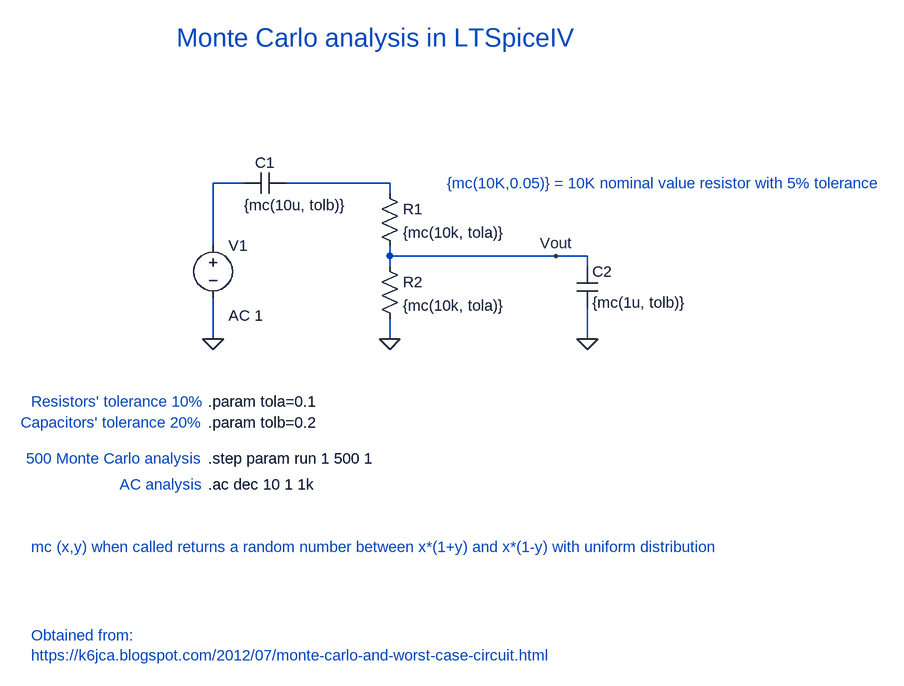
[diagram p0: schematic Monte-Carlo-Simulation-LTSpice.asc]
Monte-Carlo-Simulation-LTSpice.asc, the LTspice schematic file:
Version 4.1
SHEET 1 1064 788
WIRE 48 48 0 48
WIRE 272 48 112 48
WIRE 272 64 272 48
WIRE 0 144 0 48
WIRE 272 160 272 144
WIRE 528 160 272 160
WIRE 576 160 528 160
WIRE 272 176 272 160
WIRE 576 176 576 160
WIRE 0 288 0 224
WIRE 272 288 272 256
WIRE 576 288 576 240
FLAG 0 288 0
FLAG 272 288 0
FLAG 576 288 0
FLAG 528 160 Vout
SYMBOL voltage 0 128 R0
WINDOW 123 24 124 Left 2
WINDOW 39 0 0 Left 0
SYMATTR InstName V1
SYMATTR Value ""
SYMATTR Value2 AC 1
SYMBOL cap 112 32 R90
WINDOW 0 0 32 VBottom 2
WINDOW 3 34 -15 VTop 2
SYMATTR InstName C1
SYMATTR Value {mc(10u, tolb)}
SYMBOL res 256 48 R0
SYMATTR InstName R1
SYMATTR Value {mc(10k, tola)}
SYMBOL res 256 160 R0
SYMATTR InstName R2
SYMATTR Value {mc(10k, tola)}
SYMBOL cap 560 176 R0
SYMATTR InstName C2
SYMATTR Value {mc(1u, tolb)}
TEXT -8 384 Left 2 !.param tola=0.1
TEXT -8 416 Left 2 !.param tolb=0.2
TEXT -8 472 Left 2 !.step param run 1 500 1
TEXT -8 512 Left 2 !.ac dec 10 1 1k
TEXT -280 608 Left 2 ;mc (x,y) when called returns a random number between x*(1+y) and x*(1-y) with uniform distribution
TEXT 360 48 Left 2 ;{mc(10K,0.05)} = 10K nominal value resistor with 5% tolerance
TEXT -280 384 Left 2 ;Resistors' tolerance 10%
TEXT -296 416 Left 2 ;Capacitors' tolerance 20%
TEXT -288 472 Left 2 ;500 Monte Carlo analysis
TEXT -144 512 Left 2 ;AC analysis
TEXT -56 -176 Left 4 ;Monte Carlo analysis in LTSpiceIV
TEXT -280 744 Left 2 ;Obtained from:\nhttps://k6jca.blogspot.com/2012/07/monte-carlo-and-worst-case-circuit.html

The netlist it stands for:
* Monte-Carlo-Simulation-LTSpice.asc
V1 N001 0 AC 1
C1 N002 N001 {mc(10u, tolb)}
R1 N002 Vout {mc(10k, tola)}
R2 Vout 0 {mc(10k, tola)}
C2 Vout 0 {mc(1u, tolb)}
.param tola=0.1
.param tolb=0.2
.step param run 1 500 1
.ac dec 10 1 1k
* mc (x,y) when called returns a random number between x*(1+y) and x*(1-y) with uniform distribution
* {mc(10K,0.05)} = 10K nominal value resistor with 5% tolerance
* Resistors' tolerance 10%
* Capacitors' tolerance 20%
* 500 Monte Carlo analysis
* AC analysis
* Monte Carlo analysis in LTSpiceIV
* Obtained from:
* https://k6jca.blogspot.com/2012/07/monte-carlo-and-worst-case-circuit.html
.backanno
.end